# Altium schematic sheet ESP32_S2.SchDoc
size A; SheetNumber: 1; SheetTotal: 2
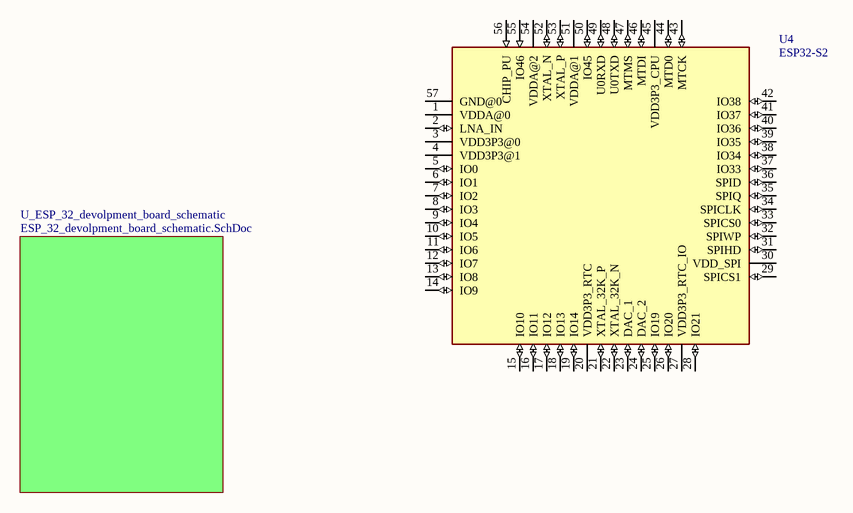
[diagram p0: ESP32_S2.SchDoc]

## Parts
U4  ESP32-S2  [QFN40P700X700X90-57T400N]

## Sub-sheets
U_ESP_32_devolpment_board_schematic = ESP_32_devolpment_board_schematic.SchDoc: no entries

## Nets

Not connected (* = marked no-connect by the designer): U4 1(VDDA@0) 2(LNA_IN) 3(VDD3P3@0) 4(VDD3P3@1) 5(IO0) 6(IO1) 7(IO2) 8(IO3) 9(IO4) 10(IO5) 11(IO6) 12(IO7) 13(IO8) 14(IO9) 15(IO10) 16(IO11) 17(IO12) 18(IO13) 19(IO14) 20(VDD3P3_RTC) 21(XTAL_32K_P) 22(XTAL_32K_N) 23(DAC_1) 24(DAC_2) 25(IO19) 26(IO20) 27(VDD3P3_RTC_IO) 28(IO21) 29(SPICS1) 30(VDD_SPI) 31(SPIHD) 32(SPIWP) 33(SPICS0) 34(SPICLK) 35(SPIQ) 36(SPID) 37(IO33) 38(IO34) 39(IO35) 40(IO36) 41(IO37) 42(IO38) 43(MTCK) 44(MTD0) 45(VDD3P3_CPU) 46(MTDI) 47(MTMS) 48(U0TXD) 49(U0RXD) 50(IO45) 51(VDDA@1) 52(XTAL_N) 53(XTAL_P) 54(VDDA@2) 55(IO46) 56(CHIP_PU) 57(GND@0)

## Library data of the parts
U4 = ESP32-S2: WiFi 802.11b/g/n Transceiver Module 2.412GHz ~ 2.484GHz Antenna Not Included Surface Mount; MF: Espressif Systems; SnapEDA_Link: https://www.snapeda.com/parts/ESP32-S2/Espressif+Systems/view-part/?ref=snap; Package: QFN-56 Espressif Systems; Value: *; MP: ESP32-S2; Check_prices: https://www.snapeda.com/parts/ESP32-S2/Espressif+Systems/view-part/?ref=eda